# EAGLE design controlboard (EAGLE 9.2.2)
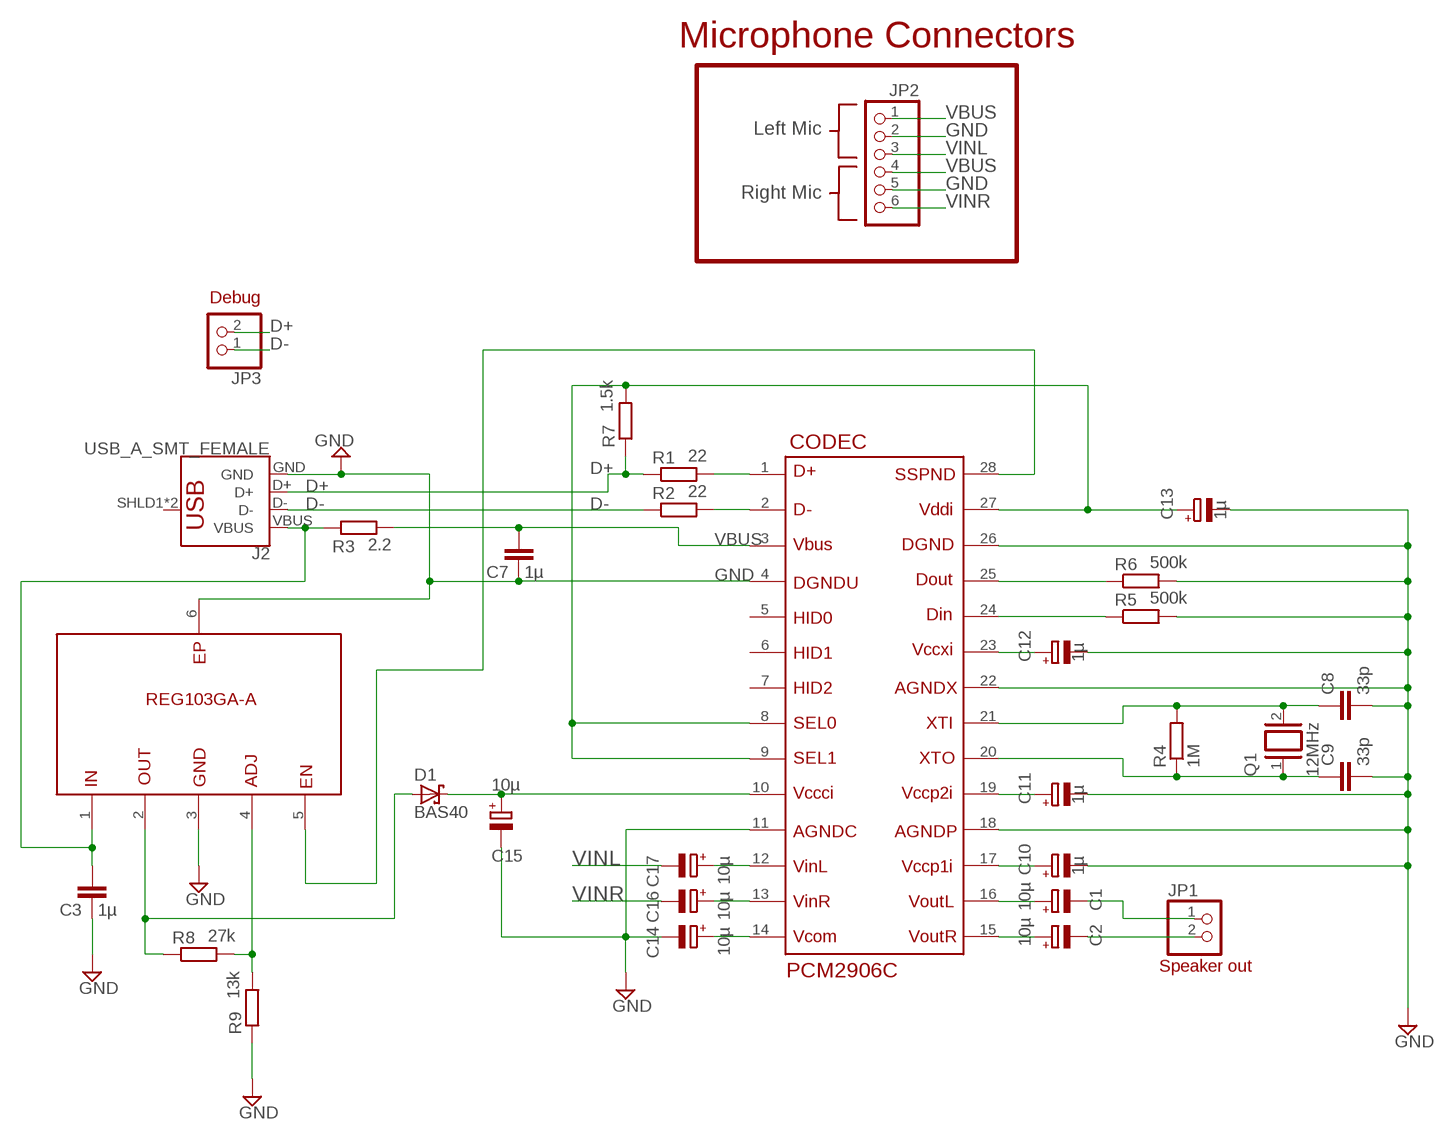
[diagram p0: schematic, sheet 1]

## Parts
C1  10µ  CPOL-EU153CLV-0807  [153CLV-0807]
C2  10µ  CPOL-EU153CLV-0807  [153CLV-0807]
C3  1µ  C-EUC0805  [C0805]
C7  1µ  C-EUC0805  [C0805]
C8  33p  C-EUC0805  [C0805]
C9  33p  C-EUC0805  [C0805]
C10  1µ  CPOL-EU153CLV-0807  [153CLV-0807]
C11  1µ  CPOL-EU153CLV-0807  [153CLV-0807]
C12  1µ  CPOL-EU153CLV-0807  [153CLV-0807]
C13  1µ  CPOL-EU153CLV-0807  [153CLV-0807]
C14  10µ  CPOL-EU153CLV-0807  [153CLV-0807]
C15  10µ  CPOL-EU153CLV-0807  [153CLV-0807]
C16  10µ  CPOL-EU153CLV-0807  [153CLV-0807]
C17  10µ  CPOL-EU153CLV-0807  [153CLV-0807]
CODEC  PCM2906C  [SOP65P780X200-28N]
D1  BAS40  [SOT23]
J2  USB_A_SMT_FEMALE  [USB-A-S-SILK-FEMALE]
JP1  PINHD-1X2  [1X02]
JP2  PINHD-1X6  [1X06]
JP3  PINHD-1X2  [1X02]
Q1  12MHz  XTAL/S  [QS]
R1  22  R-EU_R0805  [R0805]
R2  22  R-EU_R0805  [R0805]
R3  2.2  R-EU_R0805  [R0805]
R4  1M  R-EU_R0805  [R0805]
R5  500k  R-EU_R0805  [R0805]
R6  500k  R-EU_R0805  [R0805]
R7  1.5k  R-EU_R0805  [R0805]
R8  27k  R-EU_R0805  [R0805]
R9  13k  R-EU_R0805  [R0805]
U$1  REG103GA-A  [SOT127P706X180-6N]

## Nets
D+: J2.D+ JP3.2 R1.1 R7.1
D-: J2.D- JP3.1 R2.1
GND: C3.1 C7.1 C8.2 C9.2 C10.- C11.- C12.- C13.- C14.- C15.- CODEC.4 CODEC.11 CODEC.18 CODEC.22 CODEC.26 J2.GND JP2.2 JP2.5 R5.2 R6.2 R9.1 U$1.3 U$1.6
N$1: CODEC.1 R1.2
N$2: CODEC.2 R2.2
N$4: C11.+ CODEC.19
N$5: C9.1 CODEC.20 Q1.1 R4.1
N$6: C8.1 CODEC.21 Q1.2 R4.2
N$7: C10.+ CODEC.17
N$8: C12.+ CODEC.23
N$9: CODEC.25 R6.1
N$10: CODEC.24 R5.1
N$11: C13.+ CODEC.8 CODEC.9 CODEC.27 R7.2
N$12: C15.+ CODEC.10 D1.3(C)
N$13: C14.+ CODEC.14
N$14: CODEC.28 U$1.5
N$15: C1.+ CODEC.16
N$16: C2.+ CODEC.15
N$17: C17.+ CODEC.12
N$18: C16.+ CODEC.13
N$19: C1.- JP1.1
N$20: C2.- JP1.2
N$21: R8.2 R9.2 U$1.4
N$22: D1.1(A) R8.1 U$1.2
N$24: C3.2 J2.VBUS R3.1 U$1.1
VBUS: C7.2 CODEC.3 JP2.1 JP2.4 R3.2
VINL: C17.- JP2.3
VINR: C16.- JP2.6
Unconnected: CODEC.5 CODEC.6 CODEC.7 J2.SHLD1(SHIELD) J2.SHLD2(SHIELD)

## Notes on the sheet
- Microphone Connectors
- Left Mic
- Right Mic
- Debug
- Speaker out

## Library data of the parts
C1 C2 C10-C17 = resistor:CPOL-EU: POLARIZED CAPACITOR, European symbol
C3 C7-C9 = rcl:C-EU: CAPACITOR, European symbol; SPICEPREFIX: C
CODEC = PCM2906C_custom:PCM2906C
D1 = diode:BAS40: Silicon Schottky Diodes General-purpose diode for high-speed switching
J2 = SparkFun-Connectors:USB_A: USB-A Connector Male and female variants, as well as PTH and SMT variants SparkFun Products: SparkFun XBee Explorer Dongle <https://www.sparkfun.com/products/11697> PTH Male SparkFun MicroView-USB Programmer <https://www.sparkfun.com/products/12924> SMT Male SparkFun USB Type A Female Breakout <https://www.sparkfun.com/products/12700> SMT Female; PROD_ID: CONN-09520; SF_ID: PRT-09011
JP1 JP3 = pinhead:PINHD-1X2: PIN HEADER
JP2 = pinhead:PINHD-1X6: PIN HEADER
Q1 = special:XTAL/S: CRYSTAL
R1-R9 = rcl:R-EU_: RESISTOR, European symbol; SPICEPREFIX: R
U$1 = REG103GA-A:REG103GA-A

## Board
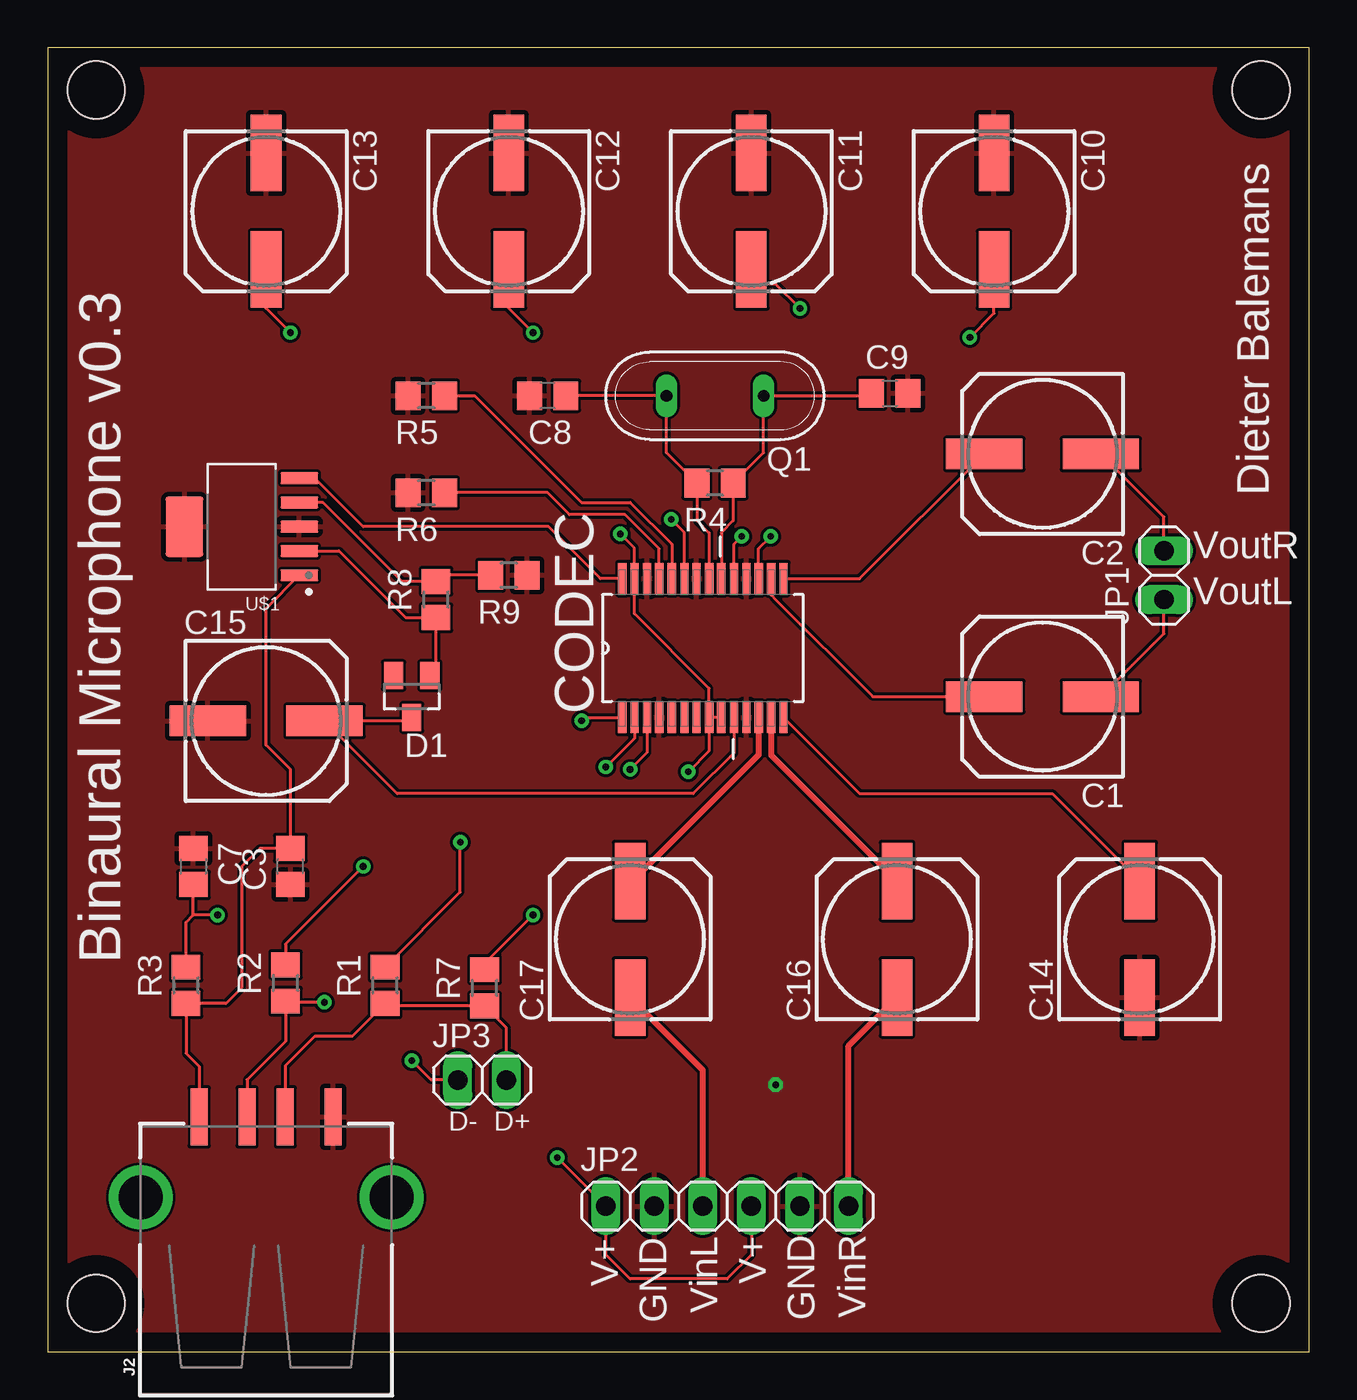
[diagram p1: board, top side]
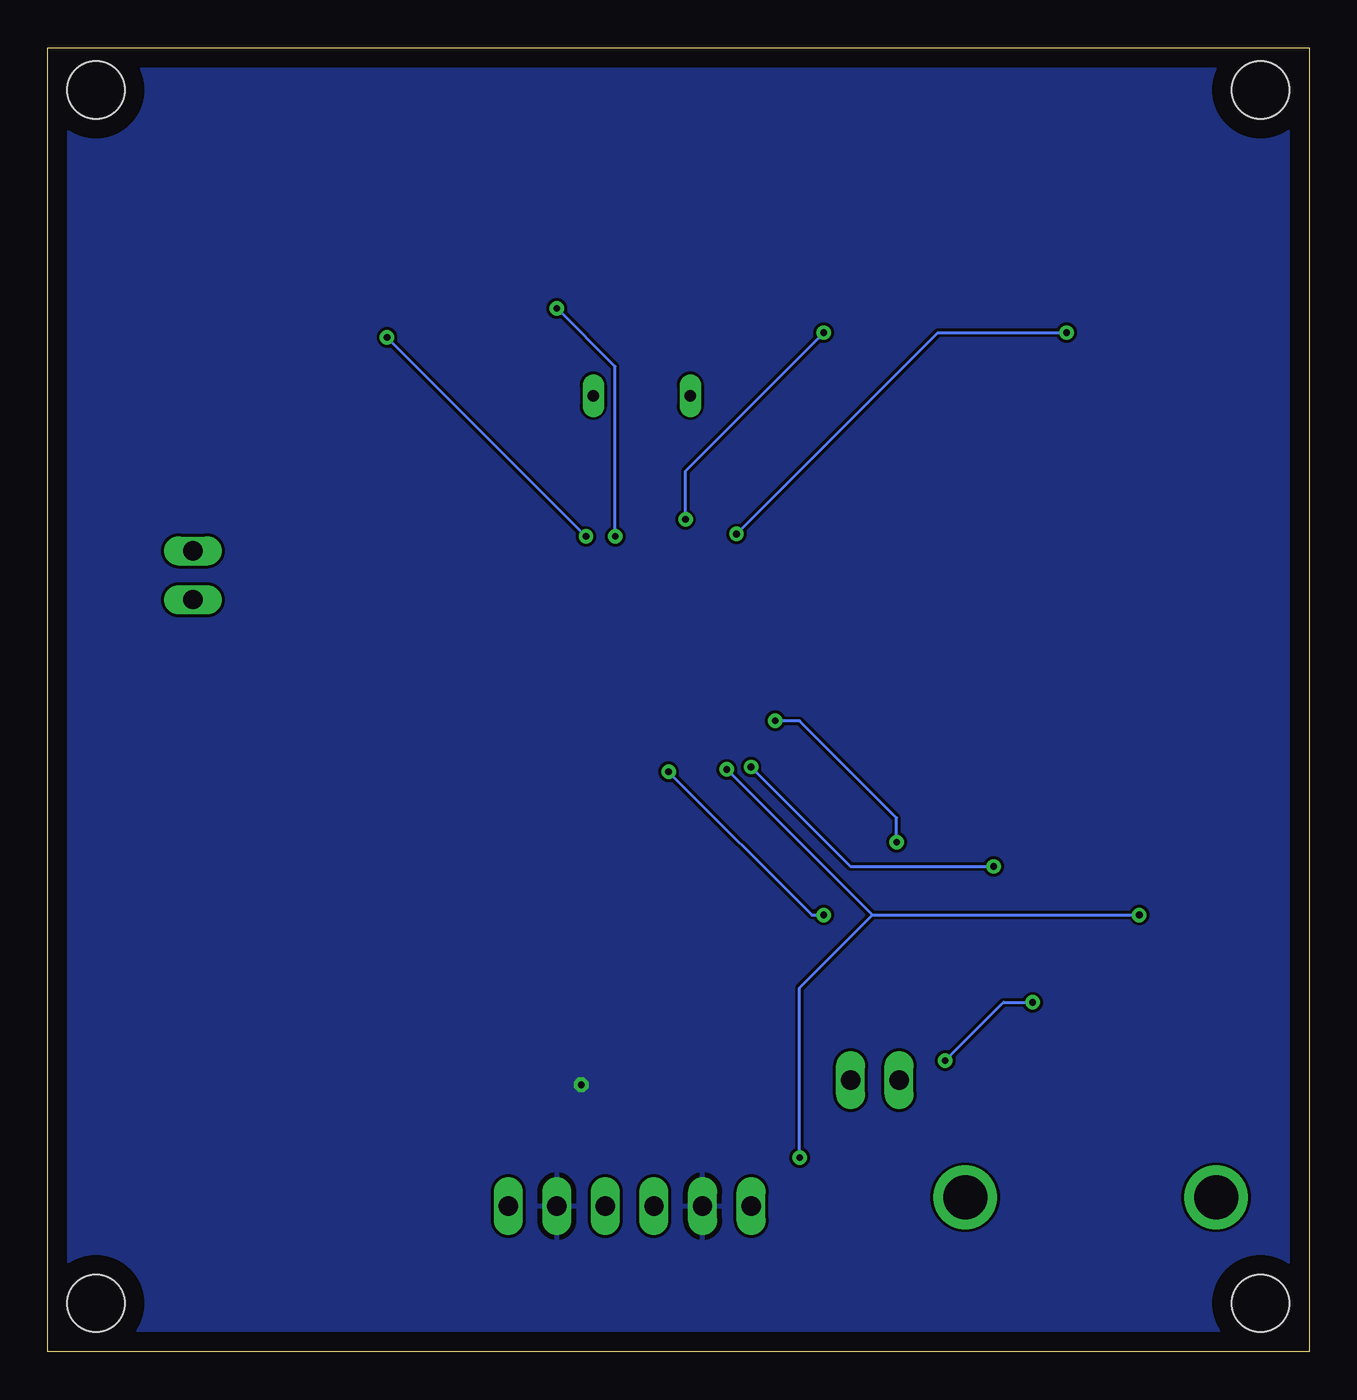
[diagram p2: board, bottom side, seen from below]

Size 66.02 x 68.25 mm. Coordinates in mm from the lower left corner, seen from the top.
Outline: 0,0 66.02,0 66.02,68.25 0,68.25 0,0
Copper layers (1*16): Top 0.035mm / dielectric 1.5mm / Bottom 0.035mm
Design rules "default": minimum track width 6mil, minimum drill 0.35mm, track to track 6mil, track to pad 6mil, pad to pad 6mil, via to via 6mil, smd to smd 6mil, copper to edge 40mil, drill to drill 6mil, minimum pad ring 10mil, minimum via ring 8mil, stop-mask expansion 4mil, vias tented up to drill 0mil, thermal gap 10mil
Holes 3 mm at 2.54,2.54 63.5,2.54 63.5,66.04 2.54,66.04

### Footprints (pad centres in the part's own frame; a part is rotated, then mirrored left to right if it is on the bottom)
153CLV-0807 = smd 4 x 1.6: + 3.05,0; - -3.05,0
C0805 = smd 1.3 x 1.5: 1 -0.95,0; 2 0.95,0
SOP65P780X200-28N = smd 1.651 x 0.432: 1 -3.632,4.216; 2 -3.632,3.581; 3 -3.632,2.921; 4 -3.632,2.286; 5 -3.632,1.626; 6 -3.632,0.965; 7 -3.632,0.33; 8 -3.632,-0.33; 9 -3.632,-0.965; 10 -3.632,-1.626; 11 -3.632,-2.286; 12 -3.632,-2.921; 13 -3.632,-3.581; 14 -3.632,-4.216; 15 3.632,-4.216; 16 3.632,-3.581; 17 3.632,-2.921; 18 3.632,-2.286; 19 3.632,-1.626; 20 3.632,-0.965; 21 3.632,-0.33; 22 3.632,0.33; 23 3.632,0.965; 24 3.632,1.626; 25 3.632,2.286; 26 3.632,2.921; 27 3.632,3.581; 28 3.632,4.216
SOT23 = smd 1 x 1.4: 1 -0.95,-1.1; 2 0.95,-1.1; 3 0,1.1
USB-A-S-SILK-FEMALE = smd 3 x 0.9: D+ 7.212,-1; D- 7.212,1; GND 7.212,-3.5; VBUS 7.212,3.5 | drill 2.311: SHLD1 3,-6.566; SHLD2 3,6.566
1X02 = drill 1.016 long: 1 -1.27,0; 2 1.27,0
1X06 = drill 1.016 long: 1 -6.35,0; 2 -3.81,0; 3 -1.27,0; 4 1.27,0; 5 3.81,0; 6 6.35,0
QS = drill 0.61 long: 1 -2.54,0; 2 2.54,0
R0805 = smd 1.3 x 1.5: 1 -0.95,0; 2 0.95,0
SOT127P706X180-6N = smd 1.97 x 0.62: 1 -3.005,2.54; 2 -3.005,1.27; 3 -3.005,0; 4 -3.005,-1.27; 5 -3.005,-2.54 | smd 1.97 x 3.16: 6 3.005,0

### Placement (x,y rotation side)
C1  52.07,34.29 180 top
C2  52.07,46.99 180 top
C3  12.7,25.4 90 top
C7  7.62,25.4 270 top
C8  26.16,50.04 180 top
C9  44.07,50.16 0 top
C10  49.53,59.69 270 top
C11  36.83,59.69 270 top
C12  24.13,59.69 270 top
C13  11.43,59.69 270 top
C14  57.15,21.59 90 top
C15  11.43,33.02 0 top
C16  44.45,21.59 90 top
C17  30.48,21.59 90 top
CODEC  34.29,36.83 90 top
D1  19.05,34.29 180 top
J2  11.43,5.08 90 top
JP1  58.42,40.64 90 top
JP2  35.56,7.62 0 top
JP3  22.73,14.22 0 top
Q1  34.92,50.04 180 top
R1  17.65,19.18 90 top
R2  12.45,19.3 90 top
R3  7.24,19.18 90 top
R4  34.92,45.47 180 top
R5  19.81,50.04 180 top
R6  19.81,44.96 180 top
R7  22.86,19.05 90 top
R8  20.32,39.37 90 top
R9  24.13,40.64 180 top
U$1  10.16,43.18 180 top

### Tracks (layer width: path | path; a pad name or v marks a point on that pad's centre or on a via)
D+
  Top 0.152: R1.1 17.53,18.1 | 17.53,18.1 15.94,16.51 13.97,16.51 12.43,14.97 J2.D+ | 17.53,18.1 R7.1 24,16.96 JP3.2
D-  (via drill 0.35)
  Top 0.152: J2.D- 10.43,14.24 12.45,16.26 R2.1 12.51,18.29 v14.48,18.29 | JP3.1 20.07,14.22 v19.05,15.24
  Bottom 0.152: v19.05,15.24 16,18.29 v14.48,18.29
GND  (via drill 0.35)
  other vias: 38.1,13.97
  pour Top: -17.78,58.42 -17.78,-7.62 -13.97,-11.43 -11.43,-13.97 82.55,-13.97 86.36,-13.97 100.33,0 100.33,69.85 88.9,81.28 -5.08,81.28 -17.78,68.58
  pour Bottom: -7.62,1.27 0,-6.35 1.27,-6.35 67.31,-6.35 74.93,1.27 74.93,68.58 68.58,74.93 -1.27,74.93 -8.89,67.31 -8.89,2.54
N$1  (via drill 0.35)
  Top 0.152: R1.2 21.59,24.06 v21.59,26.67 | v27.94,33.02 28.12,33.2 CODEC.1
  Bottom 0.152: v21.59,26.67 21.59,27.94 26.67,33.02 v27.94,33.02
N$2  (via drill 0.35)
  Top 0.152: CODEC.2 30.71,32.11 v29.21,30.61 | v16.51,25.4 12.45,21.34 R2.2
  Bottom 0.152: v29.21,30.61 24,25.4 v16.51,25.4
N$4  (via drill 0.35)
  Top 0.152: CODEC.19 35.92,42.27 v36.32,42.67 | v39.37,54.61 38.1,55.88 36.83,55.88 C11.+
  Bottom 0.152: v36.32,42.67 36.32,51.56 v39.37,54.61
N$5
  Top 0.152: CODEC.20 35.26,42.88 35.88,43.49 R4.1 37.47,47.06 Q1.1 42.99,50.04 C9.1
N$6
  Top 0.152: CODEC.21 34.62,42.85 33.98,43.49 R4.2 32.38,47.06 Q1.2 C8.1
N$7  (via drill 0.35)
  Top 0.152: CODEC.17 37.21,42.04 v37.85,42.67 | v48.26,53.09 49.53,54.36 C10.+
  Bottom 0.152: v37.85,42.67 v48.26,53.09
N$8  (via drill 0.35)
  Top 0.152: CODEC.23 33.33,42.88 v32.64,43.56 | v25.4,53.34 24.13,54.61 C12.+
  Bottom 0.152: v32.64,43.56 32.64,46.1 v25.4,53.34
N$9
  Top 0.152: CODEC.25 32,42.04 30.23,43.81 27.3,43.81 26.16,44.96 R6.1
N$10
  Top 0.152: R5.1 22.35,50.04 27.94,44.45 30.48,44.45 32.66,42.27 CODEC.24
N$11  (via drill 0.35)
  Top 0.152: CODEC.9 CODEC.8 | CODEC.8 34.62,34.72 30.71,38.63 CODEC.27 30.71,42.06 v29.97,42.8 | CODEC.8 34.62,31.45 v33.53,30.35 | v25.4,22.86 22.86,20.32 R7.2 | v12.7,53.34 11.43,54.61 C13.+
  Bottom 0.152: v33.53,30.35 26.04,22.86 v25.4,22.86 | v29.97,42.8 19.43,53.34 v12.7,53.34
N$12
  Top 0.152: CODEC.10 35.92,31.34 33.78,29.21 18.29,29.21 C15.+ 18.88,33.02 D1.3
N$13
  Top 0.152: CODEC.14 42.49,29.21 52.58,29.21 C14.+
N$14
  Top 0.152: CODEC.28 28.93,40.46 26.21,43.18 16.51,43.18 13.97,45.72 U$1.5
N$15
  Top 0.152: C1.+ 43.18,34.29 38.1,39.37 37.87,39.6 CODEC.16
N$16
  Top 0.152: CODEC.15 42.49,40.46 C2.+
N$17
  Top 0.305: CODEC.12 37.21,31.24 30.61,24.64 C17.+
N$18
  Top 0.305: C16.+ 37.87,31.22 CODEC.13
N$19
  Top 0.152: C1.- 58.42,37.59 JP1.1
N$20
  Top 0.152: JP1.2 58.42,43.69 C2.-
N$21
  Top 0.152: R9.2 20.64,40.64 R8.2 18.54,40.32 14.41,44.45 U$1.4
N$22
  Top 0.152: U$1.2 15.24,41.91 18.73,38.42 R8.1 20.32,35.71 D1.1
N$24
  Top 0.152: J2.VBUS 7.93,14.93 7.24,15.62 R3.1 9.34,18.23 10.16,19.05 10.16,25.4 11.11,26.35 C3.2 12.7,30.48 11.43,31.75 11.43,38.91 U$1.1
VBUS  (via drill 0.35)
  Top 0.152: R3.2 7.24,22.48 7.62,22.86 | 7.62,22.86 C7.2 | CODEC.3 31.37,31.37 v30.48,30.48 | v8.89,22.86 7.62,22.86 | JP2.4 36.83,5.08 35.56,3.81 30.48,3.81 29.21,5.08 JP2.1 v26.67,10.16
  Bottom 0.152: v30.48,30.48 22.86,22.86 | 22.86,22.86 v8.89,22.86 | v26.67,10.16 26.67,19.05 22.86,22.86
VINL
  Top 0.305: JP2.3 34.29,14.73 C17.-
VINR
  Top 0.305: JP2.6 41.91,16 C16.-

### Text on the board
tNames: Dieter Balemans | VoutR | VoutL | Binaural Microphone v0.3 | D- | D+ | V+ | V+ | GND | VinL | GND | VinR